# Altium schematic sheet AI语言动感单车框图.SchDoc
size A4
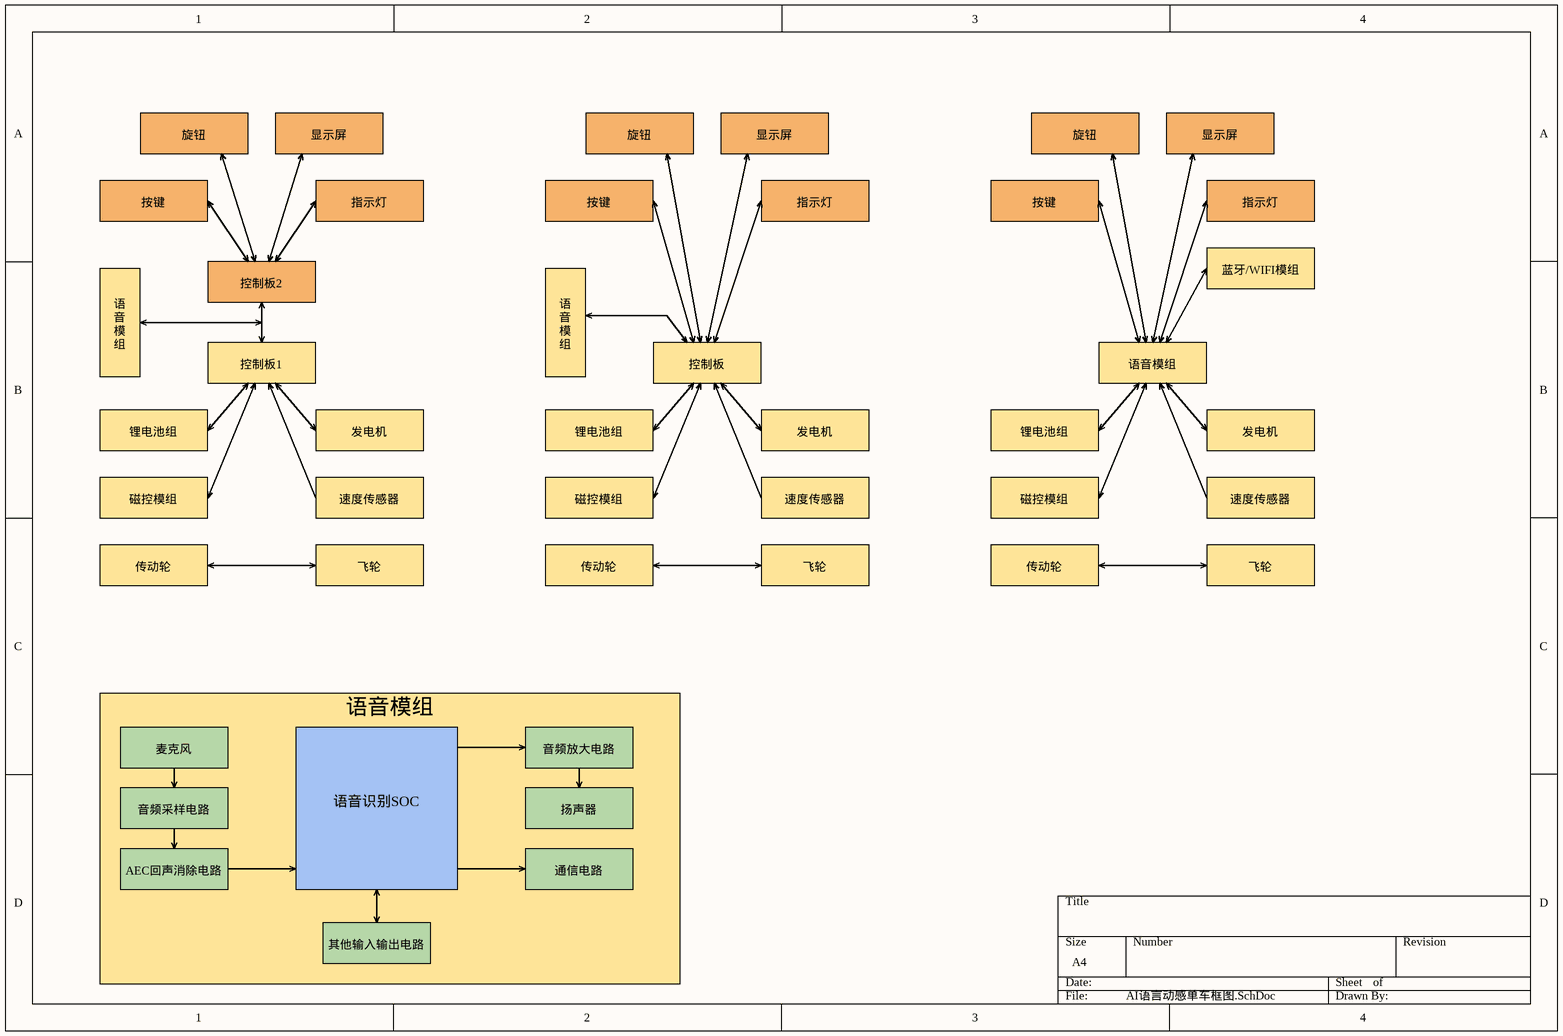
[diagram p0: AI语言动感单车框图.SchDoc]

## Notes on the sheet
- 旋钮
- 显示屏
- 按键
- 指示灯
- 控制板2
- 蓝牙/WIFI模组
- 语
  音
  模
  组
- 控制板1
- 控制板
- 语音模组
- 锂电池组
- 发电机
- 磁控模组
- 速度传感器
- 传动轮
- 飞轮
- 麦克风
- 音频放大电路
- 音频采样电路
- 扬声器
- AEC回声消除电路
- 语音识别SOC
- 通信电路
- 其他输入输出电路